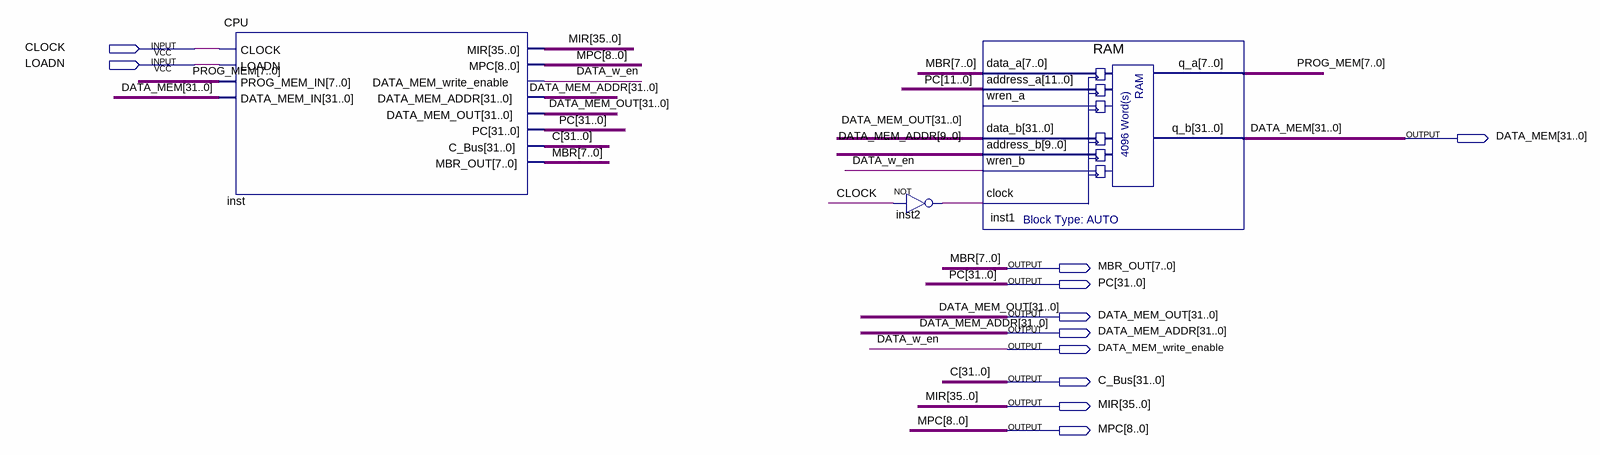
[diagram p0: schematic sheet]
// Quartus schematic MIC1.bdf as structural Verilog: 3 symbols, 11 pins
module MIC1 (
  input  CLOCK,
  input  LOADN,
  output [31:0] DATA_MEM,
  output [7:0] MBR_OUT,
  output [31:0] PC,
  output [31:0] DATA_MEM_OUT,
  output [31:0] DATA_MEM_ADDR,
  output DATA_MEM_write_enable,
  output [31:0] C_Bus,
  output [35:0] MIR,
  output [8:0] MPC
);

  wire inst2_out;
  wire [7:0] PROG_MEM;

  CPU inst (
    .CLOCK(CLOCK), .LOADN(LOADN), .PROG_MEM_IN(PROG_MEM), .DATA_MEM_IN(DATA_MEM), .MIR(MIR), .MPC(MPC),
    .DATA_MEM_write_enable(DATA_MEM_write_enable), .DATA_MEM_ADDR(DATA_MEM_ADDR),
    .DATA_MEM_OUT(DATA_MEM_OUT), .PC(PC), .C_Bus(C_Bus), .MBR_OUT(MBR_OUT));
  not inst2 (inst2_out, CLOCK);
  RAM inst1 (
    .data_a(MBR_OUT), .address_a(PC[11:0]), .data_b(DATA_MEM_OUT), .address_b(DATA_MEM_ADDR[9:0]),
    .wren_b(DATA_MEM_write_enable), .clock(inst2_out), .q_a(PROG_MEM), .q_b(DATA_MEM));  // open: wren_a

  // Other names for the same wires on the sheet: C[31:0] = C_Bus; DATA_w_en = DATA_MEM_write_enable;
  //   MBR[7:0] = MBR_OUT
endmodule
